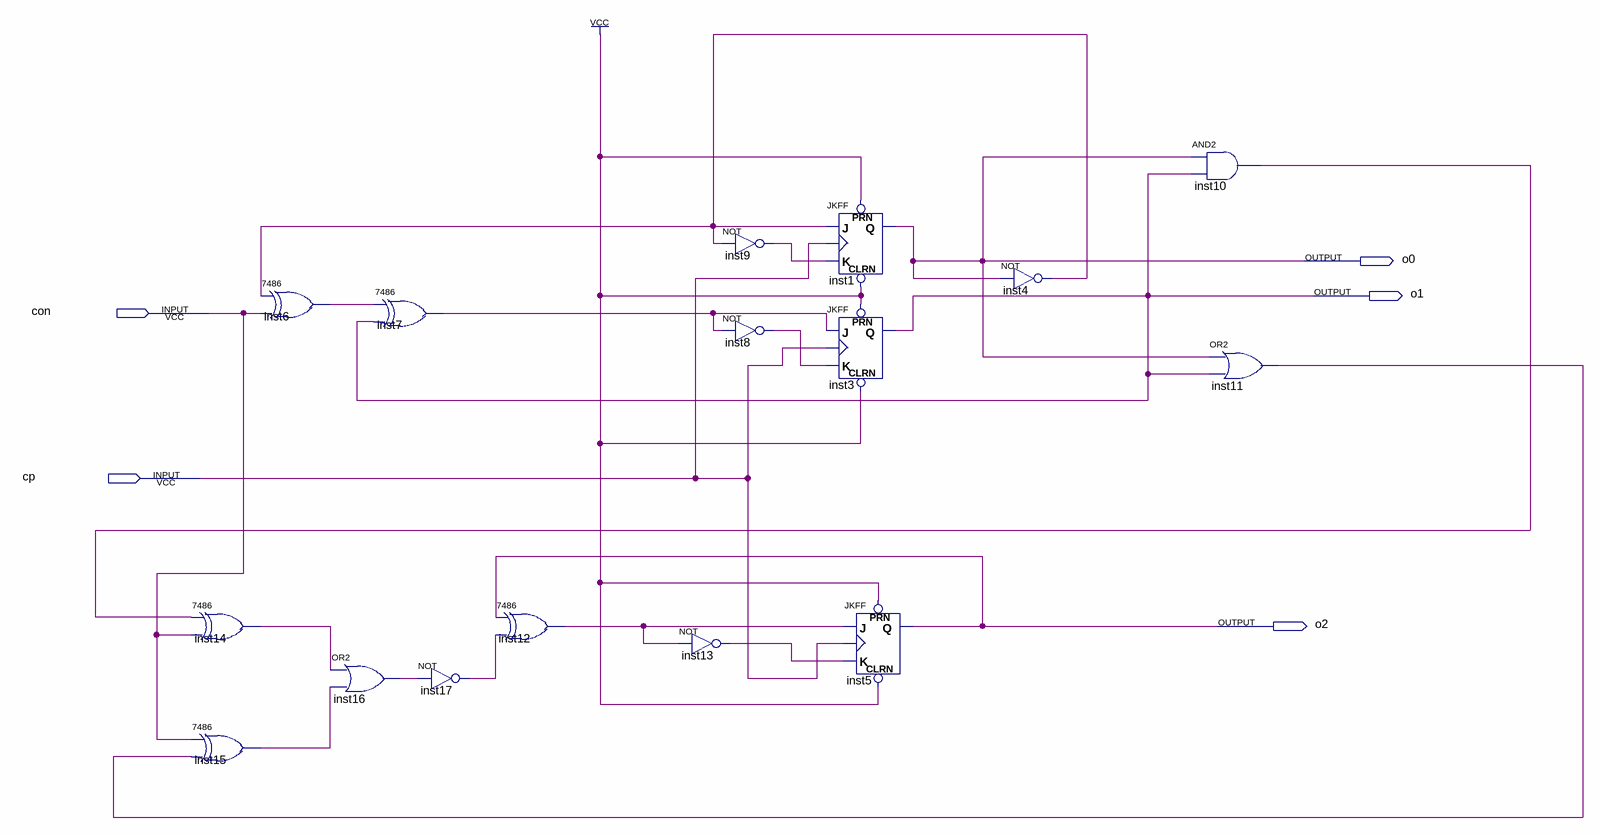
[diagram p0: schematic sheet]
// Quartus schematic 6improve.bdf as structural Verilog: 16 symbols, 5 pins
module \6improve  (
  input  con,
  input  cp,
  output o0,
  output o1,
  output o2
);

  wire inst4_out, inst6_1, inst7_1, inst8_out, inst9_out, inst10_out, inst11_out, inst12_1, inst13_out,
       inst14_1, inst15_1, inst16_out, inst17_out;

  \7486  inst14 (.\2 (inst10_out), .\3 (con), .\1 (inst14_1));
  \7486  inst15 (.\2 (con), .\3 (inst11_out), .\1 (inst15_1));
  \7486  inst6 (.\2 (inst4_out), .\3 (con), .\1 (inst6_1));
  \7486  inst7 (.\2 (inst6_1), .\3 (o1), .\1 (inst7_1));
  or inst16 (inst16_out, inst14_1, inst15_1);
  not inst17 (inst17_out, inst16_out);
  \7486  inst12 (.\2 (o2), .\3 (inst17_out), .\1 (inst12_1));
  not inst9 (inst9_out, inst4_out);
  not inst8 (inst8_out, inst7_1);
  not inst13 (inst13_out, inst12_1);
  JKFF inst1 (.PRN(1'b1), .CLRN(1'b1), .K(inst9_out), .J(inst4_out), .CLK(cp), .Q(o0));
  JKFF inst3 (.PRN(1'b1), .CLRN(1'b1), .K(inst8_out), .J(inst7_1), .CLK(cp), .Q(o1));
  JKFF inst5 (.PRN(1'b1), .CLRN(1'b1), .K(inst13_out), .J(inst12_1), .CLK(cp), .Q(o2));
  not inst4 (inst4_out, o0);
  and inst10 (inst10_out, o0, o1);
  or inst11 (inst11_out, o0, o1);
endmodule
